# Altium schematic sheet resistors.SchDoc
size 381 x 241 mm; SheetNumber: 12; SheetTotal: 12
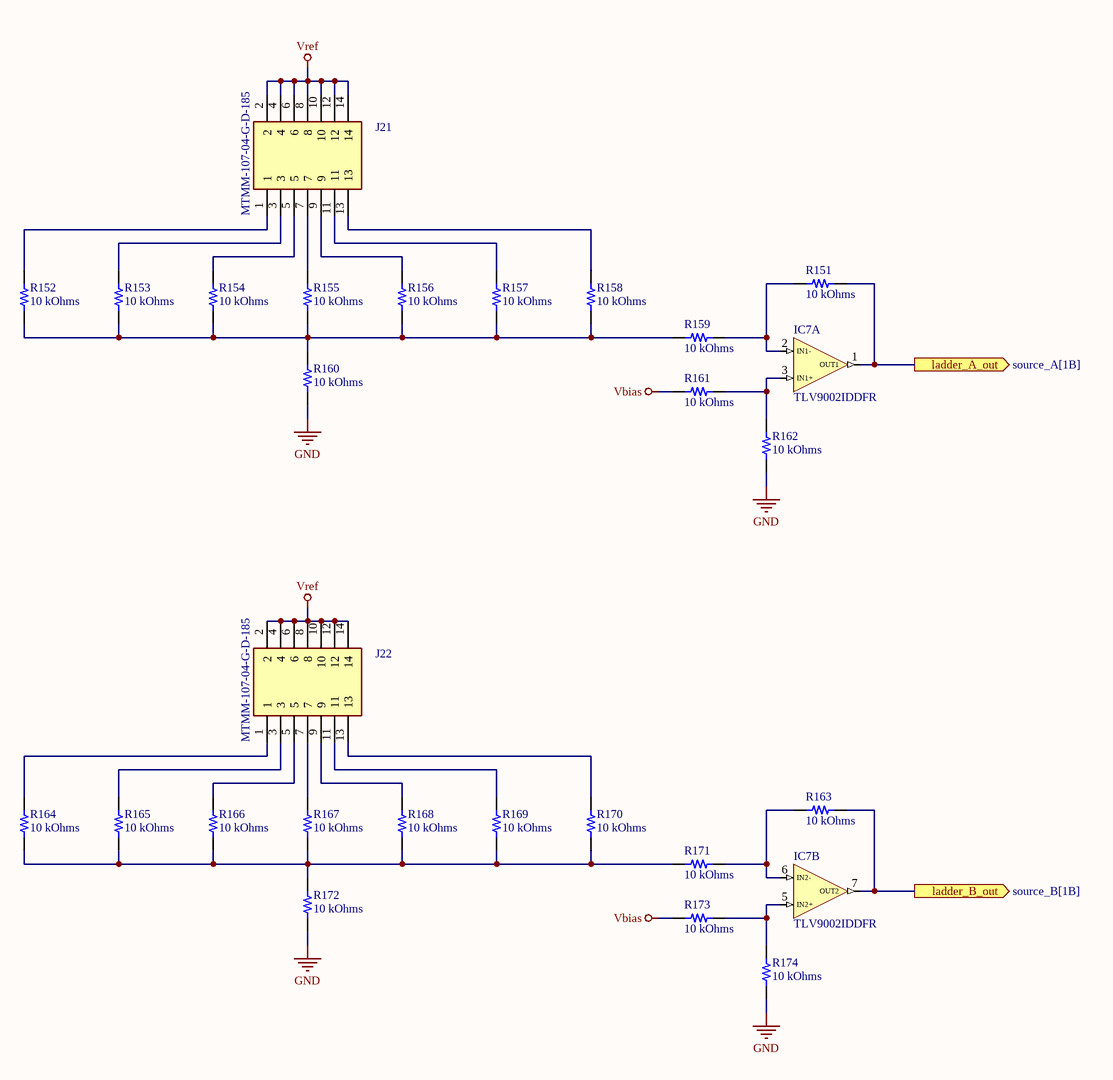
[diagram p0: resistors.SchDoc]

## Parts
IC7  TLV9002IDDFR  [SOT65P280X110-8N]  (parts A,B of 3)
J21  MTMM-107-04-G-D-185  [MTMM10704GD185]
J22  MTMM-107-04-G-D-185  [MTMM10704GD185]
R151  10 kOhms  [YAGEO RES 1206_3216]
R152  10 kOhms  [YAGEO RES 1206_3216]
R153  10 kOhms  [YAGEO RES 1206_3216]
R154  10 kOhms  [YAGEO RES 1206_3216]
R155  10 kOhms  [YAGEO RES 1206_3216]
R156  10 kOhms  [YAGEO RES 1206_3216]
R157  10 kOhms  [YAGEO RES 1206_3216]
R158  10 kOhms  [YAGEO RES 1206_3216]
R159  10 kOhms  [YAGEO RES 1206_3216]
R160  10 kOhms  [YAGEO RES 1206_3216]
R161  10 kOhms  [YAGEO RES 1206_3216]
R162  10 kOhms  [YAGEO RES 1206_3216]
R163  10 kOhms  [YAGEO RES 1206_3216]
R164  10 kOhms  [YAGEO RES 1206_3216]
R165  10 kOhms  [YAGEO RES 1206_3216]
R166  10 kOhms  [YAGEO RES 1206_3216]
R167  10 kOhms  [YAGEO RES 1206_3216]
R168  10 kOhms  [YAGEO RES 1206_3216]
R169  10 kOhms  [YAGEO RES 1206_3216]
R170  10 kOhms  [YAGEO RES 1206_3216]
R171  10 kOhms  [YAGEO RES 1206_3216]
R172  10 kOhms  [YAGEO RES 1206_3216]
R173  10 kOhms  [YAGEO RES 1206_3216]
R174  10 kOhms  [YAGEO RES 1206_3216]

## Ports
ladder_A_out (out, see source_A[1B]), ladder_B_out (out, see source_B[1B])

## Nets
GND: R160.1 R162.1 R172.1 R174.1
Vbias: R161.2 R173.2
Vref: J21.2 J21.4 J21.6 J21.8 J21.10 J21.12 J21.14 J22.2 J22.4 J22.6 J22.8 J22.10 J22.12 J22.14
ladder_A_out: IC7.1(OUT1) R151.1 ; port ladder_A_out
ladder_B_out: IC7.7(OUT2) R163.1 ; port ladder_B_out
NetIC7_2: IC7.2(IN1-) R151.2 R159.1
NetIC7_3: IC7.3(IN1+) R161.1 R162.2
NetIC7_5: IC7.5(IN2+) R173.1 R174.2
NetIC7_6: IC7.6(IN2-) R163.2 R171.1
NetJ21_1: J21.1 R152.2
NetJ21_3: J21.3 R153.2
NetJ21_5: J21.5 R154.2
NetJ21_7: J21.7 R155.2
NetJ21_9: J21.9 R156.2
NetJ21_11: J21.11 R157.2
NetJ21_13: J21.13 R158.2
NetJ22_1: J22.1 R164.2
NetJ22_3: J22.3 R165.2
NetJ22_5: J22.5 R166.2
NetJ22_7: J22.7 R167.2
NetJ22_9: J22.9 R168.2
NetJ22_11: J22.11 R169.2
NetJ22_13: J22.13 R170.2
NetR152_1: R152.1 R153.1 R154.1 R155.1 R156.1 R157.1 R158.1 R159.2 R160.2
NetR164_1: R164.1 R165.1 R166.1 R167.1 R168.1 R169.1 R170.1 R171.2 R172.2

## Library data of the parts
IC7 = TLV9002IDDFR: Integrated Circuit; Manufacturer_Name: Texas Instruments; Datasheet Link: https://www.ti.com/lit/gpn/TLV9002; Height: 1.1mm; Manufacturer_Part_Number: TLV9002IDDFR; Mouser Part Number: 595-TLV9002IDDFR; Mouser Price/Stock: https://www.mouser.co.uk/ProductDetail/Texas-Instruments/TLV9002IDDFR?qs=mAH9sUMRCtuVJ6NmNV%252Bgrw%3D%3D; Arrow Part Number: TLV9002IDDFR; Arrow Price/Stock: https://www.arrow.com/en/products/tlv9002iddfr/texas-instruments?utm_currency=USD&region=nac
J21 J22 = MTMM-107-04-G-D-185: Connector; Manufacturer_Name: SAMTEC; Datasheet Link: https://suddendocs.samtec.com/prints/mtmm-1xx-xx-xx-x-xxx-xx-xxx-mkt.pdf?_gl=1*gklr36*_gcl_aw*R0NMLjE3NDEzMjczNDIuQ2p3S0NBaUFyS1ctQmhBekVpd0FaaFdzSU81NXRXcmh5VS16b3pEZ1BfdFZablZIZUl1bFk4SG5uQlVzb0JsazkxbHVlaFo1OVhKaGZCb0N5SGtRQXZEX0J3RQ..*_gcl_au*OTA0NjU5; Height: 8.333mm; Manufacturer_Part_Number: MTMM-107-04-G-D-185; Mouser Part Number: 200-MTMM10704GD185; Mouser Price/Stock: https://www.mouser.co.uk/ProductDetail/Samtec/MTMM-107-04-G-D-185?qs=DJA8%252BIqD56WvW%2Fj12n4w4g%3D%3D
R151-R174 = RT1206FRE0710KL: RES SMD 10K OHM 1% 1/4W 1206; Manufacturer: Yageo; Power (Watts): 0.25W, 1/4W; Temperature Coefficient: ±50ppm/°C; Part Number: RT1206FRE0710KL; ComponentLink1Description: Datasheet; ComponentLink1URL: https://www.yageo.com/upload/media/product/productsearch/datasheet/rchip/PYu-RT_1-to-0.01_RoHS_L_11.pdf; ComponentLink2Description: DigiKey Link; ComponentLink2URL: https://www.digikey.com/en/products/detail/yageo/RT1206FRE0710KL/1082868; Composition: Thin Film; Device Package: 1206 (3216 Metric); Height - Seated (Max): 0.026" (0.65mm); LastUpdated: 7/25/2024 09:21:28; Lifecycle Status: Active; Minimum Order: 1; Number of Terminations: 2; Operating Temperature: -55°C ~ 155°C; Package / Case: 1206 (3216 Metric); Packaging: TapeAndReel; PartId: 38903; Part Status: Active; Price: 0.01; Resistance: 10 kOhms; Series: RT; Size / Dimension: 0.122" L x 0.063" W (3.10mm x 1.60mm); Supplier 1: DigiKey; Supplier Part Number 1: YAG1242CT-ND; Supplier Device Package: 1206; Tolerance: ±1%; Value: 10 kOhms